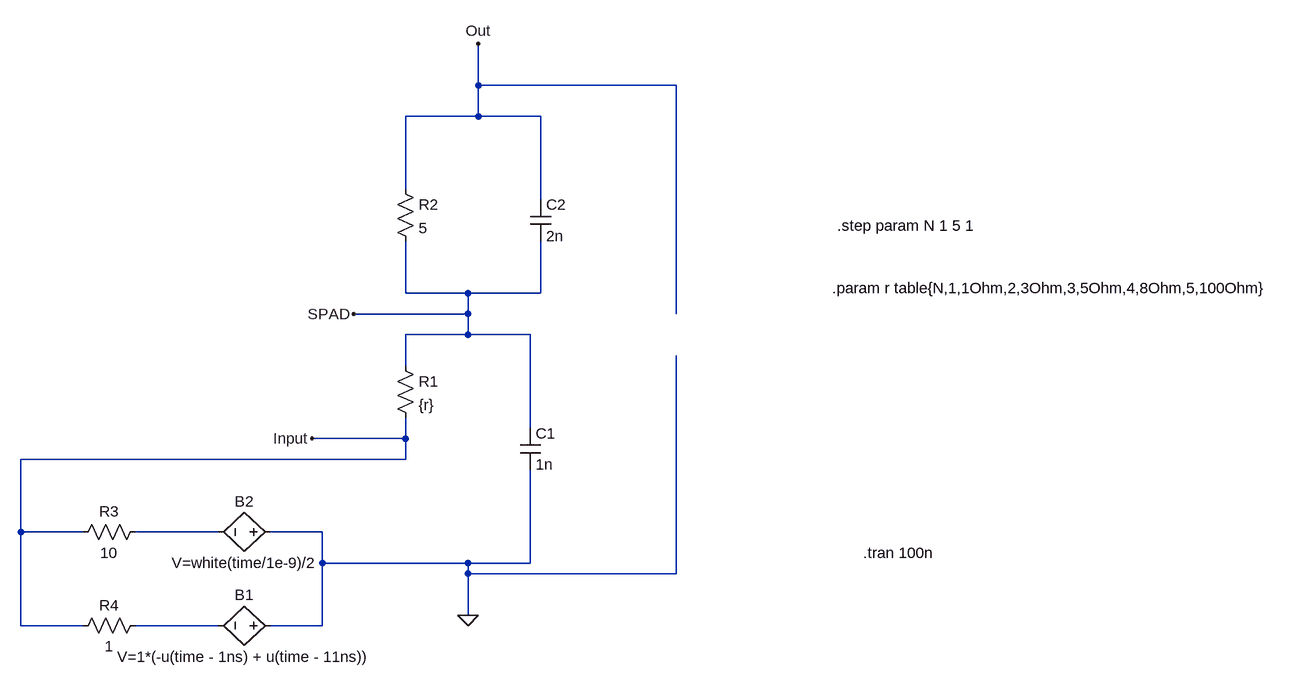
[diagram p0: schematic 1cell-cpm + noise.asc]
1cell-cpm + noise.asc, the LTspice schematic file:
Version 4
SHEET 1 1416 680
WIRE 144 -400 144 -464
WIRE 448 -400 144 -400
WIRE 144 -352 144 -400
WIRE 144 -352 32 -352
WIRE 240 -352 144 -352
WIRE 32 -240 32 -352
WIRE 240 -224 240 -352
WIRE 32 -80 32 -160
WIRE 128 -80 32 -80
WIRE 240 -80 240 -160
WIRE 240 -80 128 -80
WIRE 128 -48 128 -80
WIRE 128 -48 -48 -48
WIRE 448 -48 448 -400
WIRE 128 -16 128 -48
WIRE 128 -16 32 -16
WIRE 224 -16 128 -16
WIRE 32 32 32 -16
WIRE 224 128 224 -16
WIRE 32 144 32 112
WIRE 32 144 -112 144
WIRE 32 176 32 144
WIRE 32 176 -560 176
WIRE -560 288 -560 176
WIRE -464 288 -560 288
WIRE -256 288 -384 288
WIRE -96 288 -176 288
WIRE -96 336 -96 288
WIRE 128 336 -96 336
WIRE 224 336 224 192
WIRE 224 336 128 336
WIRE 128 352 128 336
WIRE 448 352 448 16
WIRE 448 352 128 352
WIRE 128 416 128 352
WIRE -560 432 -560 288
WIRE -464 432 -560 432
WIRE -256 432 -384 432
WIRE -96 432 -96 336
WIRE -96 432 -176 432
FLAG 128 416 0
FLAG -112 144 Input
FLAG -48 -48 SPAD
FLAG 144 -464 Out
SYMBOL res 16 16 R0
SYMATTR InstName R1
SYMATTR Value {r}
SYMBOL cap 208 128 R0
SYMATTR InstName C1
SYMATTR Value 1n
SYMBOL cap 224 -224 R0
SYMATTR InstName C2
SYMATTR Value 2n
SYMBOL res 16 -256 R0
SYMATTR InstName R2
SYMATTR Value 5
SYMBOL bv -160 432 R90
WINDOW 0 -32 56 VBottom 2
WINDOW 3 32 56 VTop 2
SYMATTR InstName B1
SYMATTR Value V=1*(-u(time - 1ns) + u(time - 11ns))
SYMBOL bv -160 288 R90
WINDOW 0 -32 56 VBottom 2
WINDOW 3 32 56 VTop 2
SYMATTR InstName B2
SYMATTR Value V=white(time/1e-9)/2
SYMBOL res -368 272 R90
WINDOW 0 0 56 VBottom 2
WINDOW 3 32 56 VTop 2
SYMATTR InstName R3
SYMATTR Value 10
SYMBOL res -368 416 R90
WINDOW 0 0 56 VBottom 2
WINDOW 3 32 56 VTop 2
SYMATTR InstName R4
SYMATTR Value 1
TEXT 736 320 Left 2 !.tran 100n
TEXT 696 -184 Left 2 !.step param N 1 5 1
TEXT 688 -88 Left 2 !.param r table{N,1,1Ohm,2,3Ohm,3,5Ohm,4,8Ohm,5,100Ohm}

The netlist it stands for:
* 1cell-cpm + noise.asc
R1 SPAD Input {r}
C1 SPAD 0 1n
C2 Out SPAD 2n
R2 Out SPAD 5
B1 0 N002 V=1*(-u(time - 1ns) + u(time - 11ns))
B2 0 N001 V=white(time/1e-9)/2
R3 N001 Input 10
R4 N002 Input 1
.tran 100n
.step param N 1 5 1
.param r table{N,1,1Ohm,2,3Ohm,3,5Ohm,4,8Ohm,5,100Ohm}
.backanno
.end